# EAGLE design Taster_LED1.43q (EAGLE 5.00)
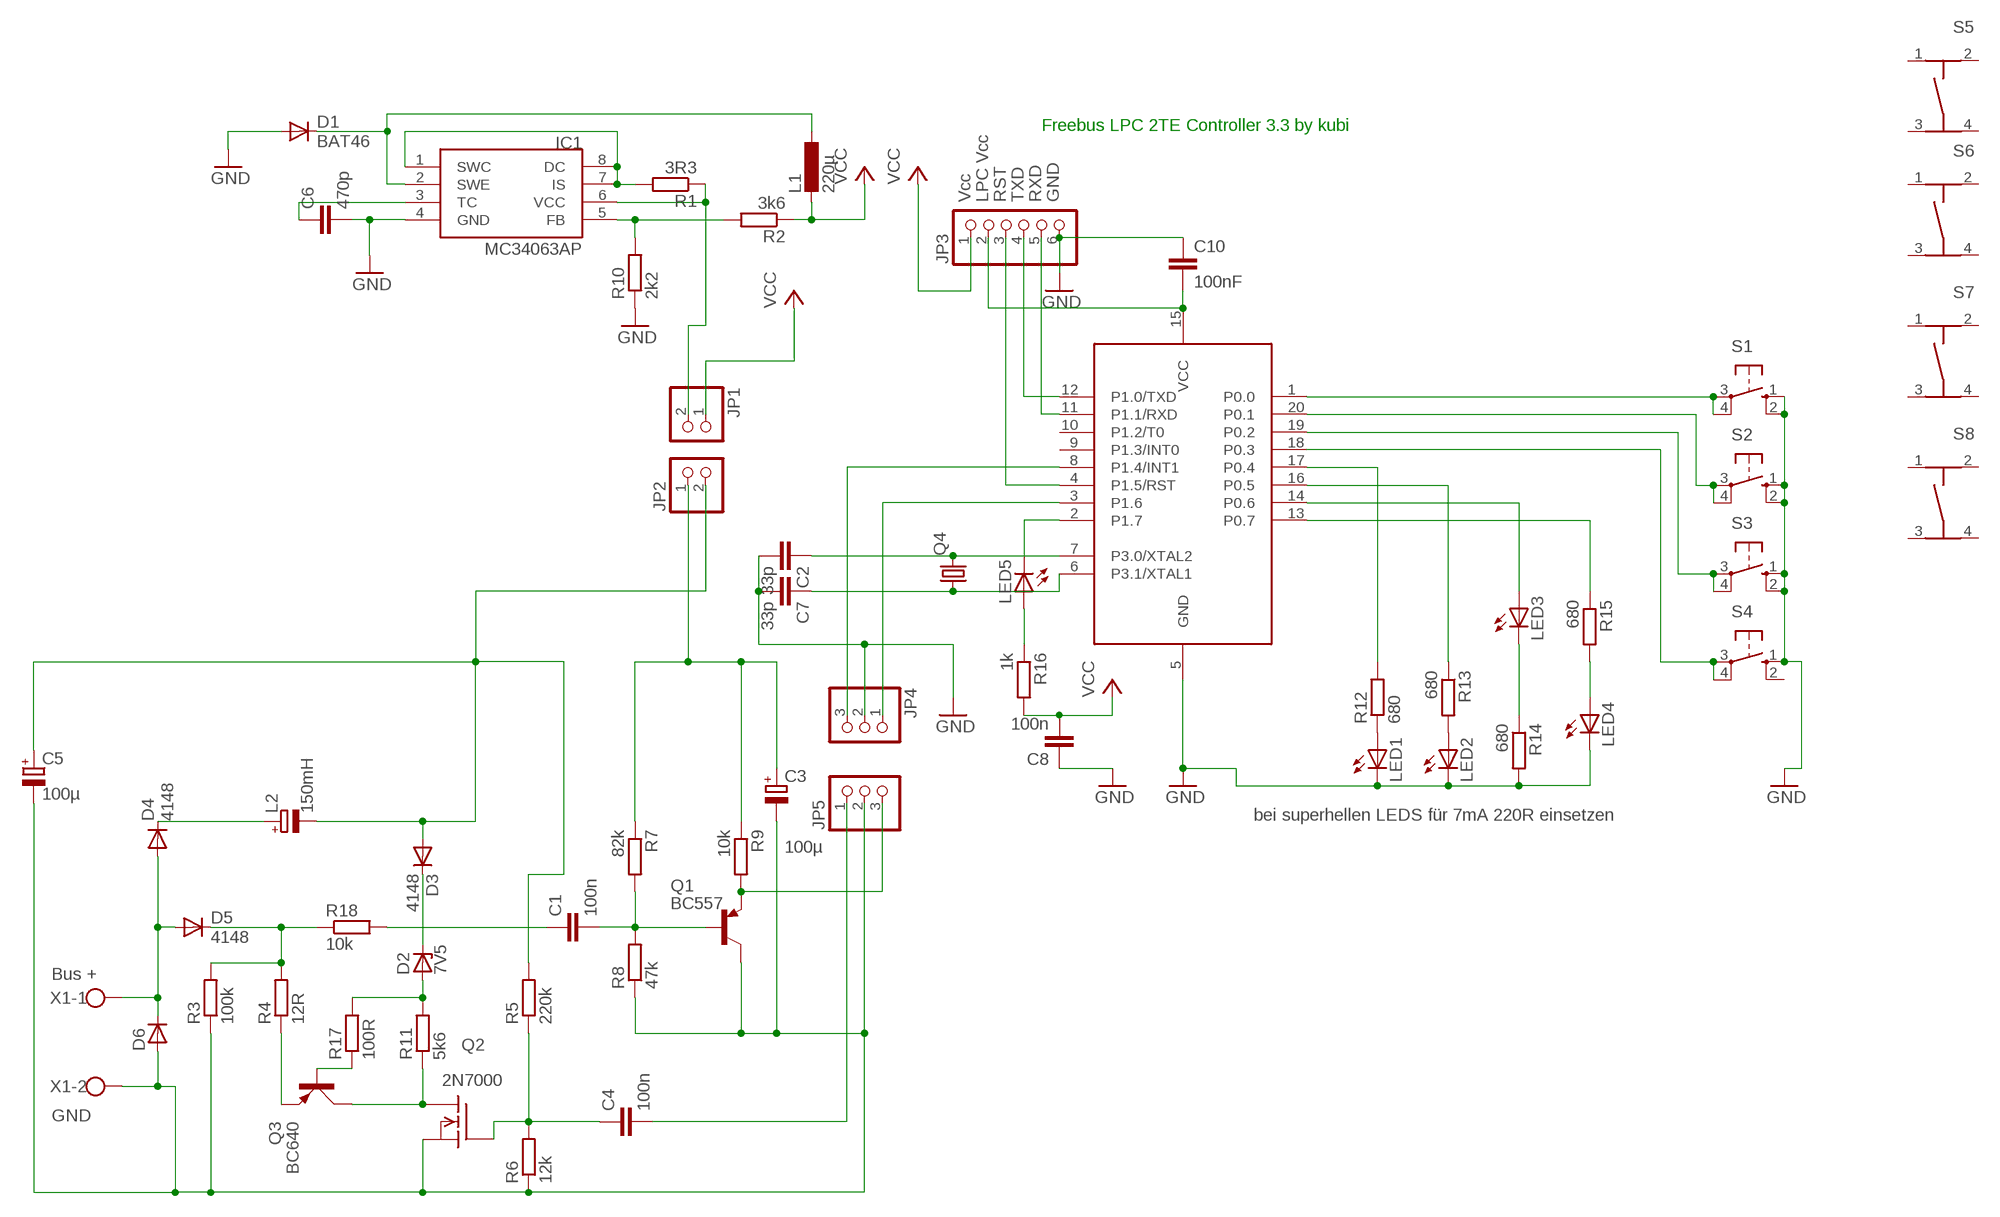
[diagram p0: schematic, sheet 1]

## Parts
C1  100n  C-EU050-024X044  [C050-024X044]
C2  33p  C-EU050-024X044  [C050-024X044]
C3  100µ  CPOL-EUE2.5-5  [E2,5-5]
C4  100n  C-EU050-024X044  [C050-024X044]
C5  100µ  CPOL-EUE3.5-8  [E3,5-8]
C6  470p  C-EU025-024X044  [C025-024X044]
C7  33p  C-EU050-024X044  [C050-024X044]
C8  100n  C-EU050-024X044  [C050-024X044]
C10  100nF  C-EUC1206  [C1206]
D1  BAT46  BAT81  [DO34-7]
D2  7V5  BZX85ZDIOV  [ZDIO-2.5]
D3  4148  1N41481448V  [D-2.5]
D4  4148  1N41481448V  [D-2.5]
D5  4148  1N41481448V  [D-2.5]
D6  D-SMB  [SMB]
IC1  MC34063AP  [DIL08]
JP1  PINHD-1X2  [1X02]
JP2  PINHD-1X2  [1X02]
JP3  PINHD-1X6  [1X06]
JP4  PINHD-1X3  [1X03]
JP5  PINHD-1X3  [1X03]
L1  220µ  L-EU2200-11.43  [2200-11.43]
L2  150mH  CPOL-EUE5-10.5  [E5-10,5]
LED1  LED3MM  [LED3MM]
LED2  LED3MM  [LED3MM]
LED3  LED3MM  [LED3MM]
LED4  LED3MM  [LED3MM]
LED5  LED3MM  [LED3MM]
Q1  BC557  [TO92]
Q2  2N7000  VN2222KM  [TO237]
Q3  BC640  [SOT54D]
Q4  CRYSTALHC49S  [HC49/S]
R1  3R3  R-EU_0204/7  [0204/7]
R2  3k6  R-EU_0204/7  [0204/7]
R3  100k  R-EU_0207/2V  [0207/2V]
R4  12R  R-EU_0207/2V  [0207/2V]
R5  220k  R-EU_0207/2V  [0207/2V]
R6  12k  R-EU_0207/2V  [0207/2V]
R7  82k  R-EU_0207/2V  [0207/2V]
R8  47k  R-EU_0207/2V  [0207/2V]
R9  10k  R-EU_0207/2V  [0207/2V]
R10  2k2  R-EU_0204/7  [0204/7]
R11  5k6  R-EU_0207/2V  [0207/2V]
R12  680  R-EU_0204/7  [0204/7]
R13  680  R-EU_0207/10  [0207/10]
R14  680  R-EU_0204/7  [0204/7]
R15  680  R-EU_0204/7  [0204/7]
R16  1k  R-EU_0204/7  [0204/7]
R17  100R  R-EU_0207/2V  [0207/2V]
R18  10k  R-EU_0207/2V  [0207/2V]
S1  10-XX  [B3F-10XX]
S2  10-XX  [B3F-10XX]
S3  10-XX  [B3F-10XX]
S4  10-XX  [B3F-10XX]
S5  TASTER-9314_SMD  [TASTER-9314_SMD]
S6  TASTER-9314_SMD  [TASTER-9314_SMD]
S7  TASTER-9314_SMD  [TASTER-9314_SMD]
S8  TASTER-9314_SMD  [TASTER-9314_SMD]
U1  89LPC922  [DIL20]
X1  W237-102  [W237-102]

## Nets
GND: C2.2 C6.2 C7.2 C8.1 C10.1 D1.A IC1.4(GND) JP3.6 JP4.2 LED1.K(C) LED2.K(C) LED4.K(C) R10.1 R14.2 S1.1(S) S1.2(S1) S2.1(S) S2.2(S1) S3.1(S) S3.2(S1) S4.1(S) U1.5(GND)
GND2: C3.- C5.- D6.2(A) JP5.2 Q1.3(C) Q2.3(S) R3.1 R6.1 R8.1 X1.2
N$1: JP5.3 Q1.1(E) R9.2
N$2: C1.2 Q1.2(B) R7.2 R8.2
N$3: D4.A D5.A D6.1(C) X1.1
N$4: D5.C R3.2 R4.2 R18.1
N$5: JP4.1 U1.3(P1.6)
N$6: D2.C D3.C
N$8: IC1.1(SWC) IC1.7(IS) IC1.8(DC) R1.2
N$10: C5.+ D3.A JP2.2 L2.- R5.2
N$11: IC1.5(FB) R2.2 R10.2
N$12: D1.C IC1.2(SWE) L1.1
N$13: D4.C L2.+
N$14: C6.1 IC1.3(TC)
N$16: LED4.A R15.2
N$17: LED1.A R12.1
N$18: LED2.A R13.2
N$19: LED3.K(C) R14.1
N$20: LED5.A R16.1
N$21: R12.2 U1.17(P0.4)
N$22: R13.1 U1.16(P0.5)
N$23: LED3.A U1.14(P0.6)
N$24: R15.1 U1.13(P0.7)
N$25: LED5.K(C) U1.2(P1.7)
N$26: D2.A R11.2 R17.2
N$27: Q2.1(D) Q3.C R11.1
N$28: Q3.E R4.1
N$29: JP3.4 U1.12(P1.0/TXD)
N$30: JP3.5 U1.11(P1.1/RXD)
N$31: JP3.3 U1.4(P1.5/RST)
N$32: C10.2 JP3.2 U1.15(VCC)
N$33: Q3.B R17.1
N$34: C4.1 Q2.2(G) R5.1 R6.2
N$35: IC1.6(VCC) JP1.2 R1.1
N$36: C2.1 Q4.2 U1.7(P3.0/XTAL2)
N$37: JP4.3 U1.8(P1.4/INT1)
N$38: C4.2 JP5.1
N$39: C3.+ JP2.1 R7.1 R9.1
N$40: C7.1 Q4.1 U1.6(P3.1/XTAL1)
N$41: C1.1 R18.2
P0.0: S1.3(P) S1.4(P1) U1.1(P0.0)
P0.1: S2.3(P) S2.4(P1) U1.20(P0.1)
P0.2: S3.3(P) S3.4(P1) U1.19(P0.2)
P0.3: S4.3(P) S4.4(P1) U1.18(P0.3)
VCC: C8.2 JP1.1 JP3.1 L1.2 R2.1 R16.2
Unconnected: S4.2(S1) S5.1 S5.2 S5.3 S5.4 S6.1 S6.2 S6.3 S6.4 S7.1 S7.2 S7.3 S7.4 S8.1 S8.2 S8.3 S8.4 U1.9(P1.3/INT0) U1.10(P1.2/T0)

## Notes on the sheet
- Freebus LPC 2TE Controller 3.3 by kubi
- Vcc | LPC Vcc | RST | TXD | RXD | GND
- bei superhellen LEDS für 7mA 220R einsetzen
- Bus +
- GND

## Library data of the parts
C1 C2 C4 C6-C8 C10 = rcl:C-EU: CAPACITOR, European symbol
C3 C5 L2 = rcl:CPOL-EU: POLARIZED CAPACITOR, European symbol
D1 = diode:BAT81: DIODE barrier diode
D2 = diode:BZX85: Z DIODE
D3-D5 = diode:1N4148: DIODE high speed (Philips)
D6 = semicon-smd-ipc:D-: DIODE unfilled
IC1 = mc34063:MC34063
JP1 JP2 = pinhead:PINHD-1X2: PIN HEADER
JP3 = pinhead:PINHD-1X6: PIN HEADER
JP4 JP5 = pinhead:PINHD-1X3: PIN HEADER
L1 = rcl:L-EU: INDUCTOR, European symbol
LED1-LED5 = led:LED: LED OSRAM: - CHIPLED LG R971, LG N971, LY N971, LG Q971, LY Q971, LO R971, LY R971 LH N974, LH R974 LS Q976, LO Q976, LY Q976 LO Q996 - Hyper CHIPLED LW Q18S LB Q993, LB Q99A, LB R99A - SideLED LS A670, LO A670, LY A670, LG A670, LP A670 LB A673, LV A673, LT A673, LW A673 LH A674 LY A675 LS A676, LA A676, LO A676, LY A676, LW A676 LS A679, LY A679, LG A679 - Hyper Micro SIDELED® LS Y876, LA Y876, LO Y876, LY Y876 LT Y87S - SmartLED LW L88C, LW L88S LB L89C, LB L89S, LG L890 LS L89K, LO L89K, LY L89K LS L896, LA L896, LO L896, LY L896 - TOPLED LS T670, LO T670, LY T670, LG T670, LP T670 LSG T670, LSP T670, LSY T670, LOP T670, LYG T670 LG T671, LOG T671, LSG T671 LB T673, LV T673, LT T673, LW T673 LH T674 LS T676, LA T676, LO T676, LY T676, LB T676, LH T676, LSB T676, LW T676 LB T67C, LV T67C, LT T67C, LS T67K, LO T67K, LY T67K, LW E67C LS E67B, LA E67B, LO E67B, LY E67B, LB E67C, LV E67C, LT E67C LW T67C LS T679, LY T679, LG T679 LS T770, LO T770, LY T770, LG T770, LP T770 LB T773, LV T773, LT T773, LW T773 LH T774 LS E675, LA E675, LY E675, LS T675 LS T776, LA T776, LO T776, LY T776, LB T776 LHGB T686 LT T68C, LB T68C - Hyper Mini TOPLED® LB M676 - Mini TOPLED Santana® LG M470 LS M47K, LO M47K, LY M47K Source: http://www.osram.convergy.de/
Q1 = transistor-pnp:BC557: PNP Transistor
Q2 = transistor-fet:VN2222KM: N-Channel Enhancement MOSFET (VMOS); 60V; 0,5A; 7,5Ohm
Q3 = transistor-small-signal:BC640: PNP TRANSISTOR
Q4 = crystal:CRYSTAL: CRYSTAL
R1-R18 = rcl:R-EU_: RESISTOR, European symbol
S1-S4 = switch-omron:10-XX: OMRON SWITCH
S5-S8 = Ergaenzung:TASTER-9314_SMD
U1 = micro-philips:89LPC922
X1 = con-wago-500:W237-102: WAGO SCREW CLAMP

## Board
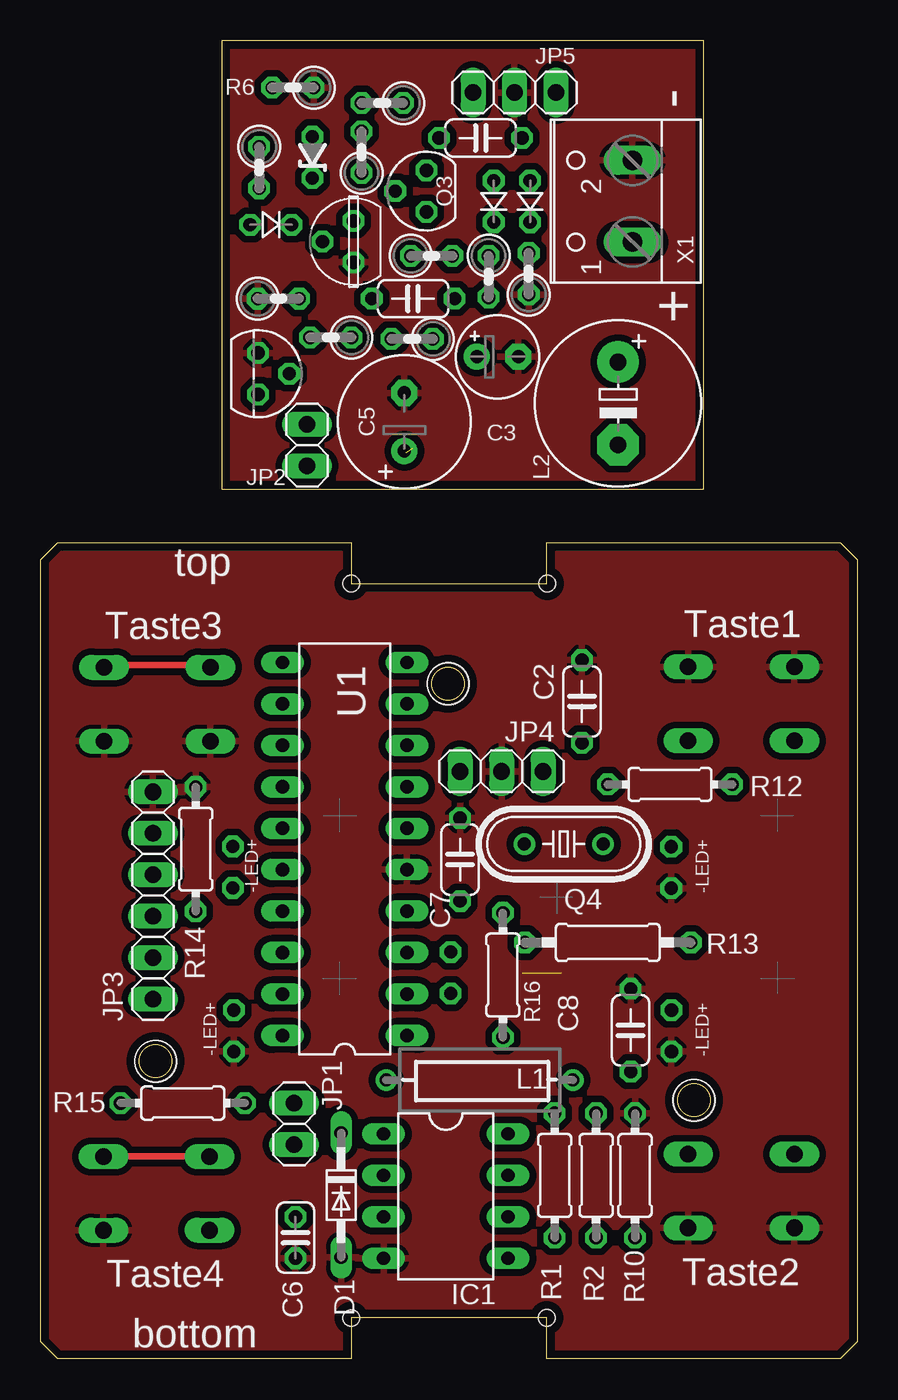
[diagram p1: board, top side]
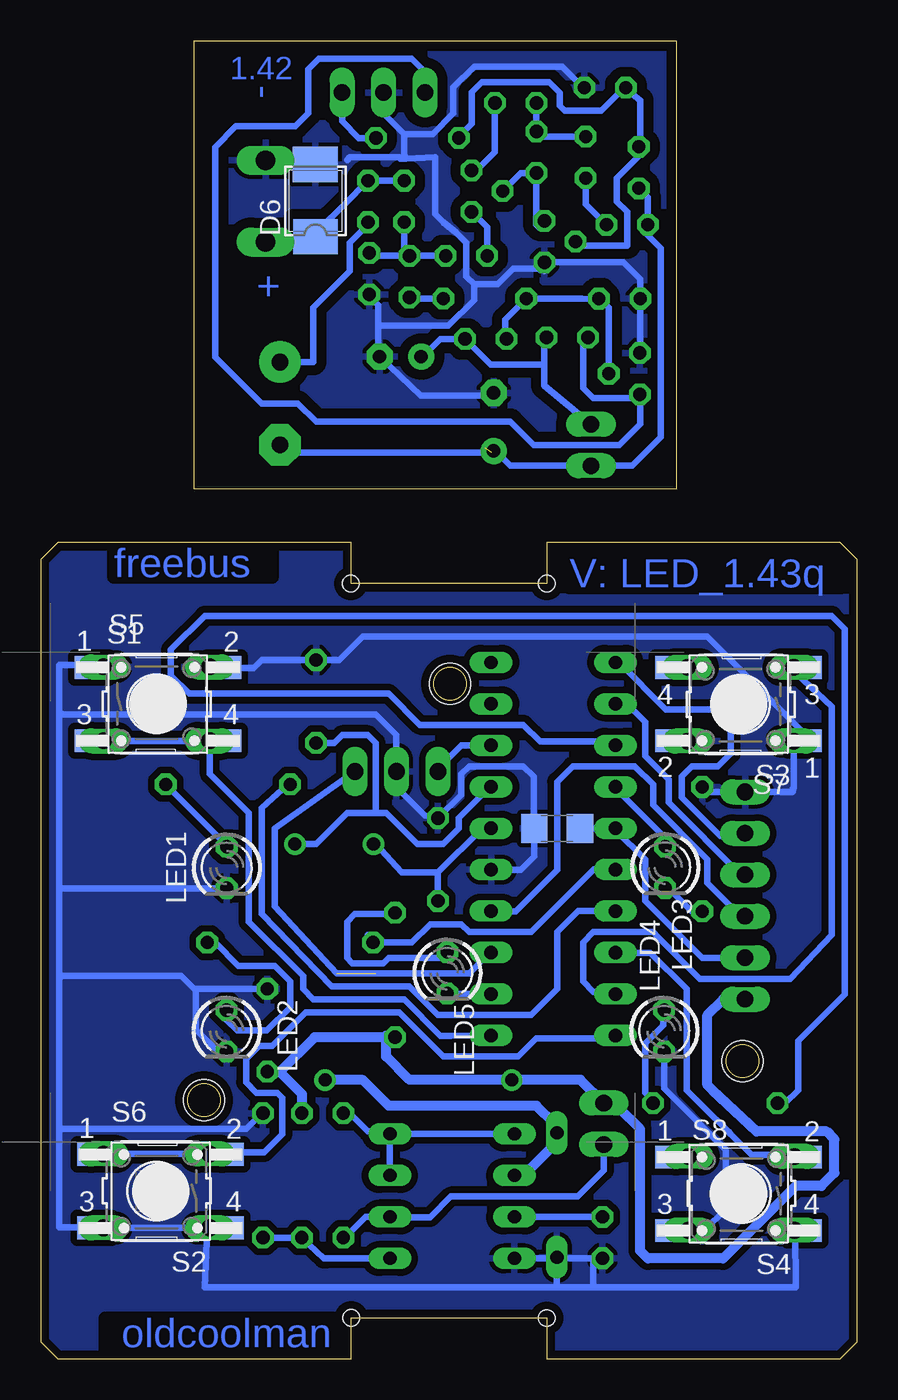
[diagram p2: board, bottom side, seen from below]

Size 50 x 80.75 mm. Coordinates in mm from the lower left corner, seen from the top.
Outline: 50,1.02 48.98,0 31,0 31,2.5 19,2.5 19,0 1.02,0 0,1.02 0,48.98 1.02,50 19,50 19,47.5 31,47.5 31,50 48.98,50 50,48.98 50,1.02
Outline: 11.07,53.29 40.6,53.29 40.6,80.75 11.07,80.75 11.07,53.29
Outline: circle at 24.95,41.36 radius 1
Outline: circle at 7.03,18.23 radius 1
Outline: circle at 40.02,15.85 radius 1
Copper layers (1*16): Top 0.035mm / dielectric 1.5mm / Bottom 0.035mm
Design rules "default *": minimum track width 12mil, minimum drill 24mil, track to track 12mil, track to pad 10mil, pad to pad 12mil, via to via 12mil, smd to smd 8mil, copper to edge 20mil, drill to drill 8mil, minimum pad ring 10mil, minimum via ring 8mil, stop-mask expansion 4mil, vias tented up to drill 0mil, thermal gap 10mil
Holes 2.5 mm at 7.03,18.23 7.03,18.23 40.02,15.84 24.95,41.35
Holes 1 mm at 19,47.51 31.01,47.51 19,2.49 31,2.5
tKeepout: area 16.3,46.7 to 33.8,47.6; area 0.1,2.7 to 4.1,47.6; area 0.2,2.6 to 50.1,3.6; area 45.9,2.7 to 50.1,47.6; area 39.7,40.9 to 45.9,47.6; area 36.3,44.3 to 39.6,47.6; area 34.6,45.9 to 36.2,47.6; area 43.1,37.6 to 45.9,40.9; area 44.7,36 to 45.9,37.5; area 41.5,39.2 to 43,40.8; area 38,42.6 to 39.7,44.3; area 40.9,3.5 to 46,10.3; 25 more areas; 10 lines
bKeepout: area 18.4,20.6 to 19.7,23.8; area 30.6,20.6 to 31.9,30.5; area 45.1,19.8 to 50.1,29.8; area 14.9,20.5 to 19.9,30.5; area 30.4,20.6 to 35.4,30.6; area 0.1,19.8 to 5.1,29.8; area 0.1,2.6 to 50.1,5.4; area 0.1,44.9 to 50.1,47.6; area 22.5,40.9 to 27.5,41.9; area 39.5,13.6 to 40.5,18; area 6.5,16 to 7.5,20.4; area 47.8,2.6 to 50.1,47.6; 1 more areas

### Footprints (pad centres in the part's own frame; a part is rotated, then mirrored left to right if it is on the bottom)
C050-024X044 = drill 0.813 octagon: 1 -2.54,0; 2 2.54,0
E2,5-5 = drill 0.813 pad 1.6 round: + -1.27,0 | drill 0.813 pad 1.6 octagon: - 1.27,0
E3,5-8 = drill 0.813 pad 1.6 round: + -1.778,0 | drill 0.813 pad 1.6 octagon: - 1.778,0
C025-024X044 = drill 0.813 octagon: 1 -1.27,0; 2 1.27,0
C1206 = smd 1.6 x 1.8: 1 -1.4,0; 2 1.4,0
DO34-7 = drill 0.813 long: A 3.81,0; C -3.81,0
ZDIO-2.5 = drill 0.813 octagon: A 1.27,0; C -1.27,0
D-2.5 = drill 0.813 octagon: A 1.27,0; C -1.27,0
SMB = smd 2.159 x 2.743: 1 -2.311,-0.127; 2 2.108,-0.102
DIL08 = drill 0.813 long: 1 -3.81,-3.81; 2 -1.27,-3.81; 3 1.27,-3.81; 4 3.81,-3.81; 5 3.81,3.81; 6 1.27,3.81; 7 -1.27,3.81; 8 -3.81,3.81
1X02 = drill 1.016 long: 1 -1.27,0; 2 1.27,0
1X06 = drill 1.016 long: 1 -6.35,0; 2 -3.81,0; 3 -1.27,0; 4 1.27,0; 5 3.81,0; 6 6.35,0
1X03 = drill 1.016 long: 1 -2.54,0; 2 0,0; 3 2.54,0
2200-11.43 = drill 0.8 pad 1.27 round: 1 -5.715,0; 2 5.715,0
E5-10,5 = drill 1.016 pad 2.54 round: + -2.54,0 | drill 1.016 pad 2.54 octagon: - 2.54,0
LED3MM = drill 0.813 octagon: A -1.27,0; K 1.27,0
TO92 = drill 0.813 octagon: 1 1.27,0; 2 0,1.905; 3 -1.27,0
TO237 = drill 0.813 octagon: 1 1.27,0; 2 0,1.905; 3 -1.27,0
SOT54D = drill 0.813 octagon: B 1.27,0; C 0,1.905; E -1.27,0
HC49/S = drill 0.813 round: 1 -2.413,0; 2 2.413,0
0204/7 = drill 0.813 octagon: 1 -3.81,0; 2 3.81,0
0207/2V = drill 0.813 octagon: 1 -1.27,0; 2 1.27,0
0207/10 = drill 0.813 octagon: 1 -5.08,0; 2 5.08,0
B3F-10XX = drill 1.016 long: 1 -3.251,2.261; 2 3.251,2.261; 3 -3.251,-2.261; 4 3.251,-2.261
TASTER-9314_SMD = smd 2.1 x 1.4: 1 -4.048,2.25; 2 4.048,2.25; 3 -4.048,-2.25; 4 4.048,-2.25
DIL20 = drill 0.813 long: 1 -11.43,-3.81; 2 -8.89,-3.81; 3 -6.35,-3.81; 4 -3.81,-3.81; 5 -1.27,-3.81; 6 1.27,-3.81; 7 3.81,-3.81; 8 6.35,-3.81; 9 8.89,-3.81; 10 11.43,-3.81; 11 11.43,3.81; 12 8.89,3.81; 13 6.35,3.81; 14 3.81,3.81; 15 1.27,3.81; 16 -1.27,3.81; 17 -3.81,3.81; 18 -6.35,3.81; 19 -8.89,3.81; 20 -11.43,3.81
W237-102 = drill 1.194 long: 1 -2.5,-1.27; 2 2.5,-1.27

### Placement (x,y rotation side)
C1  22.81,64.95 180 top
C2  33.14,40.27 90 top
C3  27.98,61.4 0 top
C4  26.94,74.8 0 top
C5  22.27,57.4 90 top
C6  15.6,7.42 270 top
C7  25.68,30.58 90 top
C8  36.13,20.12 270 top
C10  18.38,32.49 0 bottom
D1  18.39,10.03 270 top
D2  16.63,73.61 90 top
D3  14.09,69.48 180 top
D4  29.97,70.91 90 top
D5  27.74,70.91 90 top
D6  33.3,71.07 90 bottom
IC1  24.8,9.96 270 top
JP1  15.52,14.39 270 top
JP2  16.31,55.98 270 top
JP3  6.87,28.38 90 top
JP4  28.22,35.98 180 top
JP5  29.01,77.57 180 top
L1  26.87,17.08 180 top
L2  35.36,58.52 270 top
LED1  38.61,30.09 270 bottom
LED2  38.62,20.09 270 bottom
LED3  11.76,30.11 270 bottom
LED4  11.82,20.09 270 bottom
LED5  25.1,23.65 270 bottom
Q1  13.31,60.35 270 top
Q2  19.16,68.45 90 top
Q3  23.62,71.54 90 top
Q4  32.03,31.54 0 top
R1  31.47,11.23 90 top
R2  34.01,11.23 270 top
R3  29.89,66.47 90 top
R4  23.93,67.57 0 top
R5  13.38,72.98 270 top
R6  15.44,77.88 180 top
R7  22.74,62.48 180 top
R8  14.55,64.95 0 top
R9  17.76,62.57 180 top
R10  36.39,11.23 270 top
R11  19.65,73.92 90 top
R12  38.54,35.19 180 top
R13  34.73,25.5 0 top
R14  9.49,31.22 90 top
R15  8.69,15.66 0 top
R16  28.3,23.51 270 top
R17  20.92,76.94 180 top
R18  27.43,66.3 270 top
S1  42.9,40.12 0 bottom
S2  42.9,10.28 180 bottom
S3  7.13,40.1 180 bottom
S4  7.08,10.13 180 bottom
S5  42.82,40.11 0 bottom
S6  42.66,10.26 0 bottom
S7  7.26,40.11 180 bottom
S8  7.26,10.11 0 bottom
U1  18.61,31.23 90 top
X1  34.97,70.92 90 top

### Tracks (layer width: path | path; a pad name or v marks a point on that pad's centre or on a via)
GND
  Bottom 0.406: 3.79,7.87 3.93,7.72 | 16.15,4.39 3.77,4.39 3.79,7.87 | 3.79,7.87 S4.1 | 46.32,42.49 46.21,42.38 S1.1 46.11,42.38 46,42.49 48.86,42.49 48.86,39.63 | 39.65,8.2 | S2.1 39.65,8.2 | 39.65,8.2 39.83,8.02 S2.2 46.15,8.04 46.16,8.04 48.86,8.04 48.86,14.07 | S2.1 39.65,8.04 39.49,8.2 39.33,8.2 | 3.93,34.73 3.94,34.73 | 3.93,34.73 6.64,34.73 | 3.93,34.73 3.93,34.71 3.88,34.98 | 3.88,34.98 S3.1 | 10.33,37.83 10.28,37.89 | S3.2 10.33,37.83 | 16.15,5.98 16.07,6.22 C6.2 21.06,6.15 | 16.15,4.39 16.15,5.98 | 21.06,6.15 21.07,6.14 | 21.06,6.15 IC1.4 | 21.06,6.15 | R10.1 36.55,14.95 37.43,14.07 43.3,14.07 | 48.86,14.07 43.3,14.07 | 48.86,14.07 48.86,20.58 48.86,20.74 48.86,23.28 | 43.3,14.07 43.15,14.09 | JP4.2 28.22,38.2 29.17,39.16 29.49,39.47 48.7,39.47 48.86,39.63 | 39.49,42.33 39.54,42.38 S1.2 | 39.17,42.33 39.22,42.38 S1.2 | 48.86,23.28 48.86,28.84 | 48.86,28.84 48.86,39.63 | LED1.K 48.84,28.82 48.86,28.84 | 41.39,23.44 48.7,23.44 48.86,23.28 | 10.33,37.83 10.33,37.46 | 6.64,34.73 6.63,34.71 | 6.64,34.73 JP3.6 | 16.15,5.98 | 16.15,4.39 16.15,5.98 | S2.1 39.67,8.02 39.81,7.88 39.97,4.39 18.69,4.39 | 16.15,4.39 18.69,4.39 | D1.A 18.39,4.4 18.69,4.39 | 3.88,34.98 3.93,34.93 | 6.64,34.73 9.02,34.73 9.33,35.03 | 9.33,35.03 R14.2 | 9.33,35.03 9.17,35.03 | 3.93,37.89 3.29,38.36 9.17,44.24 15.84,44.24 17.26,44.24 18.69,44.24 20.28,44.24 30.28,44.24 31.71,42.81 C2.2 | LED4.K 11.82,16.57 10.12,14.87 9.49,14.23 8.06,12.8 8.06,9.15 9.33,7.88 10.44,7.88 | 39.65,42.33 | C8.1 37.41,22.66 | C2.2 | C2.2 36.47,42.81 36.95,42.33 39.65,42.33 | 39.65,42.33 S1.2 | C7.2 | C7.2 24.25,34.55 24.25,35.82 23.77,36.3 20.44,36.3 19.8,35.66 19.8,32.65 19.78,32.62 C10.1 19.78,30.77 20.6,29.95 21.39,29.95 21.88,29.96 22.49,29.96
  Bottom 0.406: C7.2 26.47,33.28 28.22,35.03 JP4.2 | JP4.2 | JP4.2 | 22.49,29.96 U1.5 | 22.49,29.96 22.5,29.95 | 40.52,22.65 37.43,22.65 | 40.52,22.65 40.6,22.65 41.39,23.44 | 41.39,23.44 | 38.62,18.84 39.17,18.84 40.52,20.19 40.52,22.65
  pour Bottom (isolate 0.406): -1.47,50.59 51.24,50.59 51.24,-0.53 -1.47,-0.53 -1.47,49.48
  pour Top (isolate 0.406): -0.2,50.43 0.28,49.95 50.13,49.95 50.29,49.79 50.29,-0.05 50.13,-0.21 -0.04,-0.21
GND2
  Bottom 0.406: Q2.3 19.41,66.7 19.33,66.78 19.17,66.62 | 22.27,59.08 C5.- 22.34,59.1 22.34,59 26.72,59 C3.- 29.33,61.45 29.33,63.29 | 29.01,76.46 29.01,76.3 27.74,75.03 | 23.46,65.83 23.93,66.3 23.93,68.37 24.57,69 25.36,69.64 25.84,70.11 25.84,73.61 27.66,73.53 | 23.46,65.83 22.03,65.83 21.07,66.78 19.01,66.78 19.01,66.84 Q2.3 | Q1.3 13.3,61.63 13.3,66.14 | 27.66,73.53 27.74,73.76 27.74,75.03 | 29.01,77.42 JP5.2 29.01,77.42 | 29.01,77.42 | 31.23,73.45 31.08,73.61 28.06,73.61 27.98,73.53 27.66,73.53 | R6.1 16.77,77.88 18.06,79.16 23.46,79.16 24.73,77.89 24.73,76.3 26,75.03 27.74,75.03 | Q2.3 14.33,67.18 13.3,66.14 | 13.3,66.14 13.28,66.13 R8.1 13.3,66.06 13.3,66.14 | R3.1 29.95,65.21 29.96,65.19 29.33,64.56 29.33,63.29 | 29.33,63.29 25.04,63.29 23.46,64.87 23.46,65.83
  pour Bottom (isolate 0.61): 10.76,80.91 10.92,81.07 40.92,81.07 41.08,80.75 41.08,52.81 10.76,52.81
  pour Top (isolate 0.406): 10.92,80.91 40.92,80.91 40.92,53.13 10.76,53.13 10.76,80.91
N$1
  Bottom 0.406: R9.2 16.79,62.27 16.79,59.48 16.15,58.84 13.55,58.84 Q1.1 13.3,59.07 13.3,57.25 14.57,55.98 19.8,55.98 21.23,57.41 33.14,57.41 34.25,58.52 36.47,58.52 39.33,61.38 39.33,74.24 38.06,75.51 34.41,75.51 33.62,76.3 33.62,79 32.98,79.64 27.27,79.64 26.47,78.84 26.47,77.73 JP5.3
N$2
  Bottom 0.406: R7.2 21.49,62.49 21.55,62.49 21.55,63.67 C1.2 16.87,64.95 15.82,64.89 R8.2 15.76,64.95 15.2,64.4 15.2,60.43 15.21,60.42 Q1.2
N$3
  Bottom 0.406: D4.A | D4.A | D5.A D4.A | D4.A | D4.A 31.39,70.75 | 31.39,70.75 | 31.39,70.75 32.97,69.17 D6.1 33.3,69.16 34.09,68.37 36.16,68.37 36.21,68.42 X1.1
N$4
  Bottom 0.406: R18.1 R4.2 | R3.2 29.88,67.65 29.81,67.57 R18.1 | R18.1 27.42,67.73 27.74,68.05 D5.C
N$5  (1 unrouted)
  Bottom 0.406: U1.3 22.49,24.88 23.77,23.6 31.87,23.6 35.68,27.73 35.68,32.49 JP4.1 | JP4.1 | JP4.1 | 29.49,23.6
N$6
  Bottom 0.406: D2.C | D2.C 16.63,70.75 D3.C | D3.C | D3.C
N$8
  Bottom 0.406: 28.61,13.84 28.69,13.92 29.96,13.92 31.09,15.04 R1.2 | 28.61,13.84 IC1.8 28.61,13.84 | IC1.1 28.55,13.77 28.61,13.84 | 28.61,13.84 IC1.7 | 28.61,13.84 28.54,13.92
N$10  (1 unrouted)
  Bottom 0.406: 12.82,69.16 | 12.82,69.16 D3.A | R5.2 12.82,71.16 12.82,69.16 | 22.82,55.83 22.78,55.78 | L2.- 35.33,56.14 35.04,55.51 22.38,55.51 C5.+ 22.23,55.62 22.19,55.67 21.23,54.71 JP2.2 16.79,54.71 13.77,54.71 12.03,56.46 12.03,68.05 12.82,68.84 12.82,69.16
N$11
  Bottom 0.406: IC1.5 29,6.15 32.5,6.14 32.68,6.15 R2.2 34.11,7.42 | 34.11,7.42 R10.2 | 34.11,7.42 34.09,7.41
N$12
  Bottom 0.406: 20.43,11.23 IC1.2 | 18.69,12.96 18.69,13.92 18.71,13.9 D1.C 18.66,14.32 | 18.66,14.32 18.71,14.41 | 18.53,14.39 18.6,14.32 18.66,14.32 | 29.17,15.98
  Bottom 0.61: 18.69,12.96 20.43,11.23 | L1.1 30.27,17.08 29.17,15.98 28.69,15.5 19.65,15.5 18.53,14.39
N$13
  Bottom 0.406: D4.C | L2.+ 33.3,61.06 33.3,64.4 31.08,66.62 31.08,68.37 29.96,69.48 D4.C
N$14
  Bottom 0.406: C6.1 21.54,8.69 21.55,8.68 21.23,8.68 21.22,8.69 IC1.3
N$16
  Bottom 0.406: LED4.A 11.87,20.68 11.87,20.42 12.98,19.31 12.98,19 12.98,16.3 12.5,15.82 R15.2
N$17
  Bottom 0.406: R12.1 | LED1.A 38.61,31.45 R12.1
N$18
  Bottom 0.406: R13.2 | R13.2 | R13.2 39.33,25.5 37.9,24.08 35.68,24.08 34.73,23.12 34.73,21.54 36.16,20.11 37.98,20.11 38.62,20.74 38.62,21.36 LED2.A
N$19
  Bottom 0.406: LED3.K 11.76,28.95 11.71,29 10.12,27.41 R14.1
N$20
  Bottom 0.406: 28.28,27.32 R16.1 28.37,27.25 30.76,27.25 31.23,26.77 31.23,24.55 30.92,24.23 29.01,24.23 28.69,24.55 25.47,24.55 LED5.A
N$21
  Bottom 0.406: U1.17 17.09,27.42 18.38,26.14 18.38,22.65 19.96,21.06 25.68,21.06 | R12.2 | 25.68,21.06 | 25.68,21.06 27.27,22.65 | 27.27,22.65 | 27.27,22.65 27.42,22.81 32.19,22.81 36.47,27.25 36.47,33.76 34.89,35.19 R12.2
N$22
  Bottom 0.406: U1.16 16.14,29.96 19.96,26.14 23.77,26.14 24.25,26.62 26.15,26.62 | 26.15,26.62 | 29.96,25.98 29.81,25.98 R13.1 29.81,25.5 27.27,25.5 26.15,26.62
N$23
  Bottom 0.406: U1.14 14.87,35.04 14.88,35.03 11.76,31.9 LED3.A
N$24
  Bottom 0.406: U1.13 14.8,37.81 19.41,37.81 20.44,38.84 26.79,38.84 28.69,40.74 28.85,40.74 | 28.85,40.74 | 28.85,40.74 40.92,40.74 42.03,41.86 42.03,43.44 39.97,45.51 1.55,45.51 0.75,44.71 0.75,22.33 3.61,19.47 3.61,16.46 4.41,15.66 R15.1
N$25
  Bottom 0.406: LED5.K 25.04,22.33 25.03,22.34 U1.2
N$26
  Bottom 0.406: D2.A 19.17,74.88 19.49,75.19 R11.2 R17.2 | R17.2
N$27
  Bottom 0.406: 19.65,69.8 R11.1 | 19.65,69.8 | Q2.1 19.47,69.31 19.65,69.48 19.65,69.8 | R11.1 19.65,72.34 19.96,72.34 | Q3.C 20.6,72.65 R11.1
N$28
  Bottom 0.406: Q3.E 22.66,69.32 R4.1
N$29
  Bottom 0.406: JP3.4 7.12,29.65 11.55,34.08 11.55,35.51 12.98,36.93 12.98,39 14.09,40.11 14.72,40.11 14.74,40.12 U1.12
N$30
  Bottom 0.406: JP3.5 8.39,32.03 10.76,34.39 10.76,35.66 10.12,36.3 8.53,36.3 7.74,37.09 7.74,38.68 8.85,39.79 11.71,39.79 14.58,42.66 U1.11
N$31
  Bottom 0.406: JP3.3 7.12,27.11 9.17,29.16 9.17,30.58 12.5,33.92 12.5,35.19 13.61,36.3 17.42,36.3 18.38,35.35 18.38,29.95 20.92,27.41 22.34,27.41 22.36,27.42 U1.4
N$32
  Bottom 0.406: JP3.2 9.5,24.57 10.12,25.19 | 10.12,25.19 | 10.12,25.19 12.98,28.04 12.98,30.58 14.8,32.41 U1.15 16.93,32.5 16.98,32.46 | 16.98,32.46 17.11,32.33 | 16.98,32.46 C10.2
N$33
  Bottom 0.406: Q3.B 23.3,72.81 22.19,73.92 R17.1
N$34
  Bottom 0.406: 17.09,68.19 Q2.2 17.11,68.13 17.11,68.21 14.09,68.21 14.09,70.27 14.72,70.91 14.72,72.34 13.37,73.69 R5.1 13.31,74.25 13.3,74.24 13.3,75.03 13.3,77.1 13.31,77.08 R6.2 | 23.6,77.59 23.61,75.67 24.49,74.8 C4.1 | R6.2 13.38,77.18 | 23.6,77.59 | 23.6,77.59 22.98,78.21 18.85,78.21 18.22,77.57 18.22,76.78 17.9,76.46 15.68,76.46 14.25,77.89 14.23,77.88 R6.2
N$35
  Bottom 0.406: R1.1 31.41,7.42 31.39,7.41 30.11,8.69 IC1.6 28.68,8.69 28.69,8.68 26.15,8.68 24.88,9.95 17.11,9.95 15.52,11.53 JP1.2 | JP1.2
N$36
  Bottom 0.406: Q4.2 33.14,31.54 31.23,33.44 29.49,33.44 | C2.1 32.03,37.73 31.55,38.2 29.96,38.2 29.49,37.73 29.49,33.44 | U1.7 22.49,35.04 24.41,33.12 24.41,32.49 25.36,31.54 26.95,31.54 28.85,33.44 29.49,33.44
N$37
  Bottom 0.406: 25.68,36.14 | JP4.3 25.68,36.14 | U1.8 24.24,37.58 25.68,36.14
N$38
  Bottom 0.406: C4.2 30.52,74.8 31.55,75.83 JP5.1 | JP5.1
N$39
  Bottom 0.406: R9.1 19.17,62.4 19.17,60.91 | JP2.1 19.17,59.64 19.17,60.91 | 19.17,60.91 22.44,60.91 R7.1 25.53,62.48 26.63,61.38 26.64,61.4 C3.+
N$40
  Bottom 0.406: U1.6 22.97,32.5 25.68,29.79 25.84,29.79 | Q4.1 29.49,31.54 27.9,29.79 25.84,29.79 | C7.1 25.68,29.63 25.84,29.79
N$41
  Bottom 0.406: R18.2 | C1.1 27.35,64.95 R18.2
P0.0
  Bottom 0.406: U1.1 23.12,19.8 24.88,19.79 25.52,19.79 | 39.49,37.89 39.51,37.86 S1.4 | 46.15,37.88 46.16,37.89 | 46.15,37.88 S1.3 | S1.4 46.13,37.86 46.15,37.88 | 37.43,33.6 39.65,35.82 39.65,37.73 S1.4 | 25.52,19.79 | 25.52,19.79 27.74,22.01 33.3,22.01 33.93,22.65 33.93,23.44 37.27,26.77 37.27,33.44 37.43,33.6 | 37.43,33.6
P0.1
  Bottom 0.406: 39.65,12.64 39.65,12.65 | 39.65,12.64 S2.3 39.54,12.65 36.31,12.65 35.2,13.76 35.2,15.98 35.52,16.3 36.79,16.3 37.43,16.93 37.43,18.36 36.63,19.15 35.84,19.15 33.93,21.06 33.77,21.22 28.06,21.22 25.36,18.52 20.76,18.52 19.65,19.63 14.98,19.63 U1.20 | S2.4 39.76,12.54 39.65,12.64
P0.2  (via drill 0.6)
  Top 0.406: 10.44,42.36 10.44,42.33 | 10.44,42.36 S3.4 | v3.93,42.49 10.44,42.49 10.44,42.36
  Bottom 0.406: U1.19 14.95,22.49 16.15,22.49 16.79,23.12 16.79,25.5 16.15,26.14 13.3,26.14 12.5,26.14 12.18,25.82 9.64,23.28 4.09,23.28 1.55,25.98 1.55,39.95 3.77,42.01 3.77,42.47 | 3.77,42.47 3.77,42.49 | 3.77,42.47 S3.3 3.88,42.44 v3.93,42.49 3.93,42.33
P0.3
  Top 0.406: S4.3 3.93,12.39 | 3.93,12.39 S4.4 | 3.93,12.39 3.93,12.33
  Bottom 0.406: S4.3 4.09,12.39 4.72,12.49 | 4.72,12.49 4.25,12.49 | 4.72,12.49 6.47,12.49 7.74,13.76 | 7.74,13.76 | 7.74,13.76 7.9,13.92 9.49,15.5 10.44,16.46 10.44,22.65 12.66,24.87 14.82,24.87 | 14.82,24.87 14.88,24.87 | 14.82,24.87 U1.18
VCC
  Bottom 0.406: 33.77,15.03 33.79,15.04 R2.1 33.95,15.04 33.93,15.03 | 8.2,22.03 JP3.1 | 28.85,19.79 28.94,19.71 R16.2 | 20.92,17.09 21.07,17.09 21.15,17.17 L1.2 | C8.2 36.16,17.57 35.36,17.57
  Bottom 0.61: 8.2,22.03 9.17,21.06 9.17,16.77 8.85,16.46 6.15,13.92 1.87,13.92 1.39,13.44 1.39,11.38 2.18,10.58 3.77,10.58 8.22,6.14 12.82,6.14 13.3,6.61 13.3,12.8 13.3,14.07 14.57,15.34 JP1.1 16.95,17.09 20.92,17.09 27.42,17.09 28.85,18.52 28.85,19.79 | R16.2 33.23,19.7 35.36,17.57 34.01,16.22 R2.1

### Text on the board
Bottom: 1.42 | - | + | V: LED_1.43q | freebus | oldcoolman
tPlace: - | + | top | Taste1 | Taste3 | -LED+ | -LED+ | -LED+ | -LED+ | Taste4 | Taste2 | bottom